# Altium schematic sheet Metacarpal.SchDoc
size A4; SheetNumber: 8; SheetTotal: 8
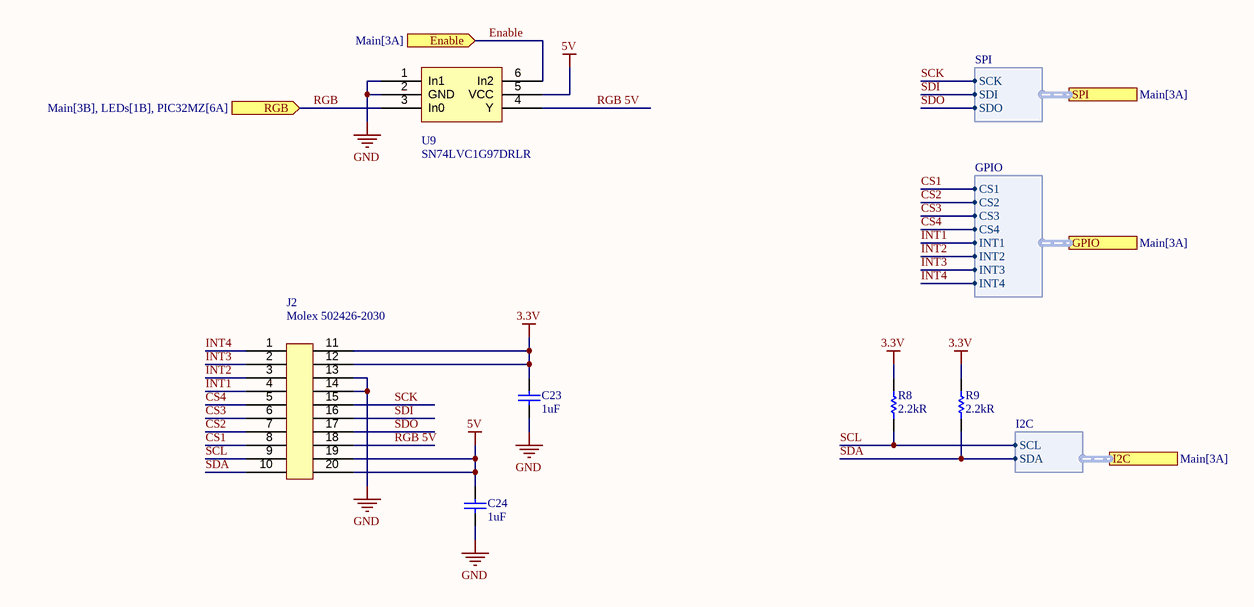
[diagram p0: Metacarpal.SchDoc]

## Parts
C23  1uF  [Capacitor 0402]
C24  1uF  [Capacitor 0402]
J2  Molex 502426-2030  [Molex 502426-2030]
R8  2.2kR  [Resistor 0402]
R9  2.2kR  [Resistor 0402]
U9  SN74LVC1G97DRLR  [SOT-666]

## Ports
Enable (in, see Main[3A]), GPIO (harness GPIO, see Main[3A]), I2C (harness I2C, see Main[3A]), RGB (in, see Main[3B], LEDs[1B], PIC32MZ[6A]), SPI (harness SPI, see Main[3A])

## Harnesses
SPI: SCK, SDI, SDO
GPIO: CS1, CS2, CS3, CS4, INT1, INT2, INT3, INT4
I2C: SCL, SDA

## Nets
3.3V: C23.2 J2.11 J2.12 R8.2 R9.2
5V: C24.2 J2.19 J2.20 U9.5(VCC)
GND: C23.1 C24.1 J2.13 J2.14 U9.1(In1) U9.2(GND)
CS1: J2.8 ; port GPIO.CS1
CS2: J2.7 ; port GPIO.CS2
CS3: J2.6 ; port GPIO.CS3
CS4: J2.5 ; port GPIO.CS4
Enable: U9.6(In2) ; port Enable
INT1: J2.4 ; port GPIO.INT1
INT2: J2.3 ; port GPIO.INT2
INT3: J2.2 ; port GPIO.INT3
INT4: J2.1 ; port GPIO.INT4
RGB: U9.3(In0) ; port RGB
RGB 5V: J2.18 U9.4(Y)
SCK: J2.15 ; port SPI.SCK
SCL: J2.9 R8.1 ; port I2C.SCL
SDA: J2.10 R9.1
SDI: J2.16 ; port SPI.SDI
SDO: J2.17 ; port SPI.SDO

## Notes on the sheet
- TITLE
- SIZE
- A4
- VARIANT
- PROJECT
- SHEET
- VERSION
- OF
- AUTHOR
- DATE

## Library data of the parts
C23 C24 = Capacitor
R8 R9 = Resistor